# Altium schematic sheet Sheet5.SchDoc
size A4; SheetNumber: 5; SheetTotal: 5
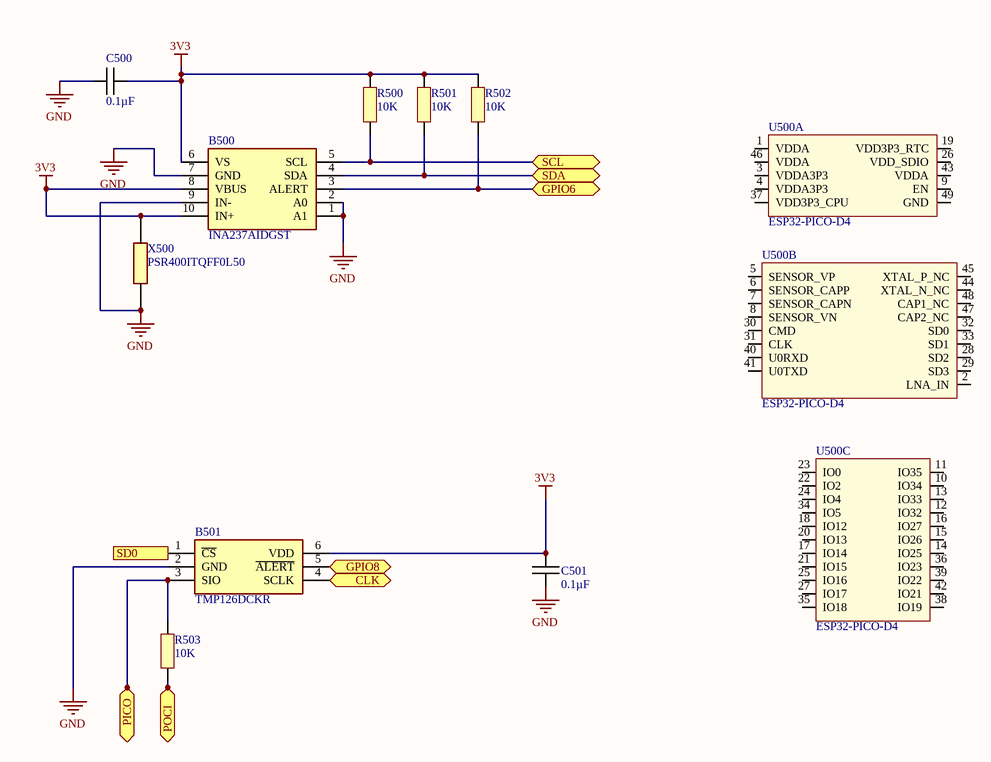
[diagram p0: Sheet5.SchDoc]

## Parts
B500  INA237AIDGST  [SOP50P490X110-10N]
B501  TMP126DCKR  [SOT65P210X110-6N]
C500  0.1µF  [CAPC1005X06N]
C501  0.1µF  [CAPC1005X06N]
R500  10K  [RESC1005X06N]
R501  10K  [RESC1005X06N]
R502  10K  [RESC1005X06N]
R503  10K  [RESC1005X06N]
U500  ESP32-PICO-D4  [PQFN50P700X700X104_HS-49N]  (parts A,B,C of 3)
X500  PSR400ITQFF0L50  [RESC10052X200N]

## Ports
CLK (bidir), GPIO6 (bidir), GPIO8 (bidir), PICO (bidir), POCI (bidir), SCL (bidir), SD0 (in), SDA (bidir)

## Nets
3V3: B500.6(VS) B500.8(VBUS) B500.10(IN+) B501.6(VDD) C500.2 C501.2 R500.2 R501.2 R502.2 X500.2
GND: B500.1(A1) B500.2(A0) B500.7(GND) B500.9(IN-) B501.2(GND) C500.1 C501.1 X500.1
CLK: B501.4(SCLK) ; port CLK
GPIO6: B500.3(ALERT) R502.1 ; port GPIO6
GPIO8: B501.5(~{ALERT}) ; port GPIO8
PICO: B501.3(SIO) R503.1 ; port PICO
POCI: R503.2 ; port POCI
SCL: B500.5(SCL) R500.1 ; port SCL
SD0: B501.1(~{CS}) ; port SD0
SDA: B500.4(SDA) R501.1 ; port SDA

Not connected (* = marked no-connect by the designer): U500 1(VDDA) 2(LNA_IN) 3(VDDA3P3) 4(VDDA3P3) 5(SENSOR_VP) 6(SENSOR_CAPP) 7(SENSOR_CAPN) 8(SENSOR_VN) 9(EN) 10(IO34) 11(IO35) 12(IO32) 13(IO33) 14(IO25) 15(IO26) 16(IO27) 17(IO14) 18(IO12) 19(VDD3P3_RTC) 20(IO13) 21(IO15) 22(IO2) 23(IO0) 24(IO4) 25(IO16) 26(VDD_SDIO) 27(IO17) 28(SD2) 29(SD3) 30(CMD) 31(CLK) 32(SD0) 33(SD1) 34(IO5) 35(IO18) 36(IO23) 37(VDD3P3_CPU) 38(IO19) 39(IO22) 40(U0RXD) 41(U0TXD) 42(IO21) 43(VDDA) 44(XTAL_N_NC) 45(XTAL_P_NC) 46(VDDA) 47(CAP2_NC) 48(CAP1_NC) 49(GND)

## Library data of the parts
B500 = INA237AIDGST: Current Sense Amplifiers 85-V, 16-bit, I2C output current/voltage/power monitor with alert 10-VSSOP -40 to 125; Manufacturer_Name: Texas Instruments; Manufacturer_Part_Number: INA237AIDGST; Mouser Part Number: 595-INA237AIDGST
B501 = TMP126DCKR: Board Mount Temperature Sensors +/-0.25 C SPI temperature sensor with 175 C operation, CRC and slew-rate alert; Manufacturer_Name: Texas Instruments; Manufacturer_Part_Number: TMP126DCKR; Mouser Part Number: 595-TMP126DCKR
C500 C501 = Capacitor
R500-R503 = Resistor
U500 = ESP32: Système RF sur puce - SoC SIP module ESP32 with 4MByte Flash, Dual Core MCU, Wi-Fi & Bluetooth Combo, LGA48-pin, 7*7mm; Manufacturer 1: Espressif Systems; Supplier 1: Digi-Key; Supplier Part Number 1: 1904-1029-1-ND; Manufacturer Part Number 1: ESP32-PICO-D4
X500 = PSR400ITQFF0L50: ROHM - PSR400ITQFF0L50 - SMD Current Sense Resistor, 500 ohm, PSR Series, 3921 [1052 Metric], 4 W, +/- 1%, Metal Strip; Manufacturer_Name: ROHM Semiconductor; Geometry.Height: 2mm; Manufacturer_Part_Number: PSR400ITQFF0L50; Mouser Part Number: 755-PSR400ITQFF0L50; Mouser Price/Stock: https://www.mouser.co.uk/ProductDetail/ROHM-Semiconductor/PSR400ITQFF0L50?qs=493kPxzlxfLaT1w5Mo%252BtHg%3D%3D; Arrow Part Number: *; Arrow Price/Stock: *; Datasheet Link: https://componentsearchengine.com/Datasheets/2/PSR400ITQFF0L50.pdf